# EAGLE design ESP devkit ver.1 (EAGLE 9.6.2)
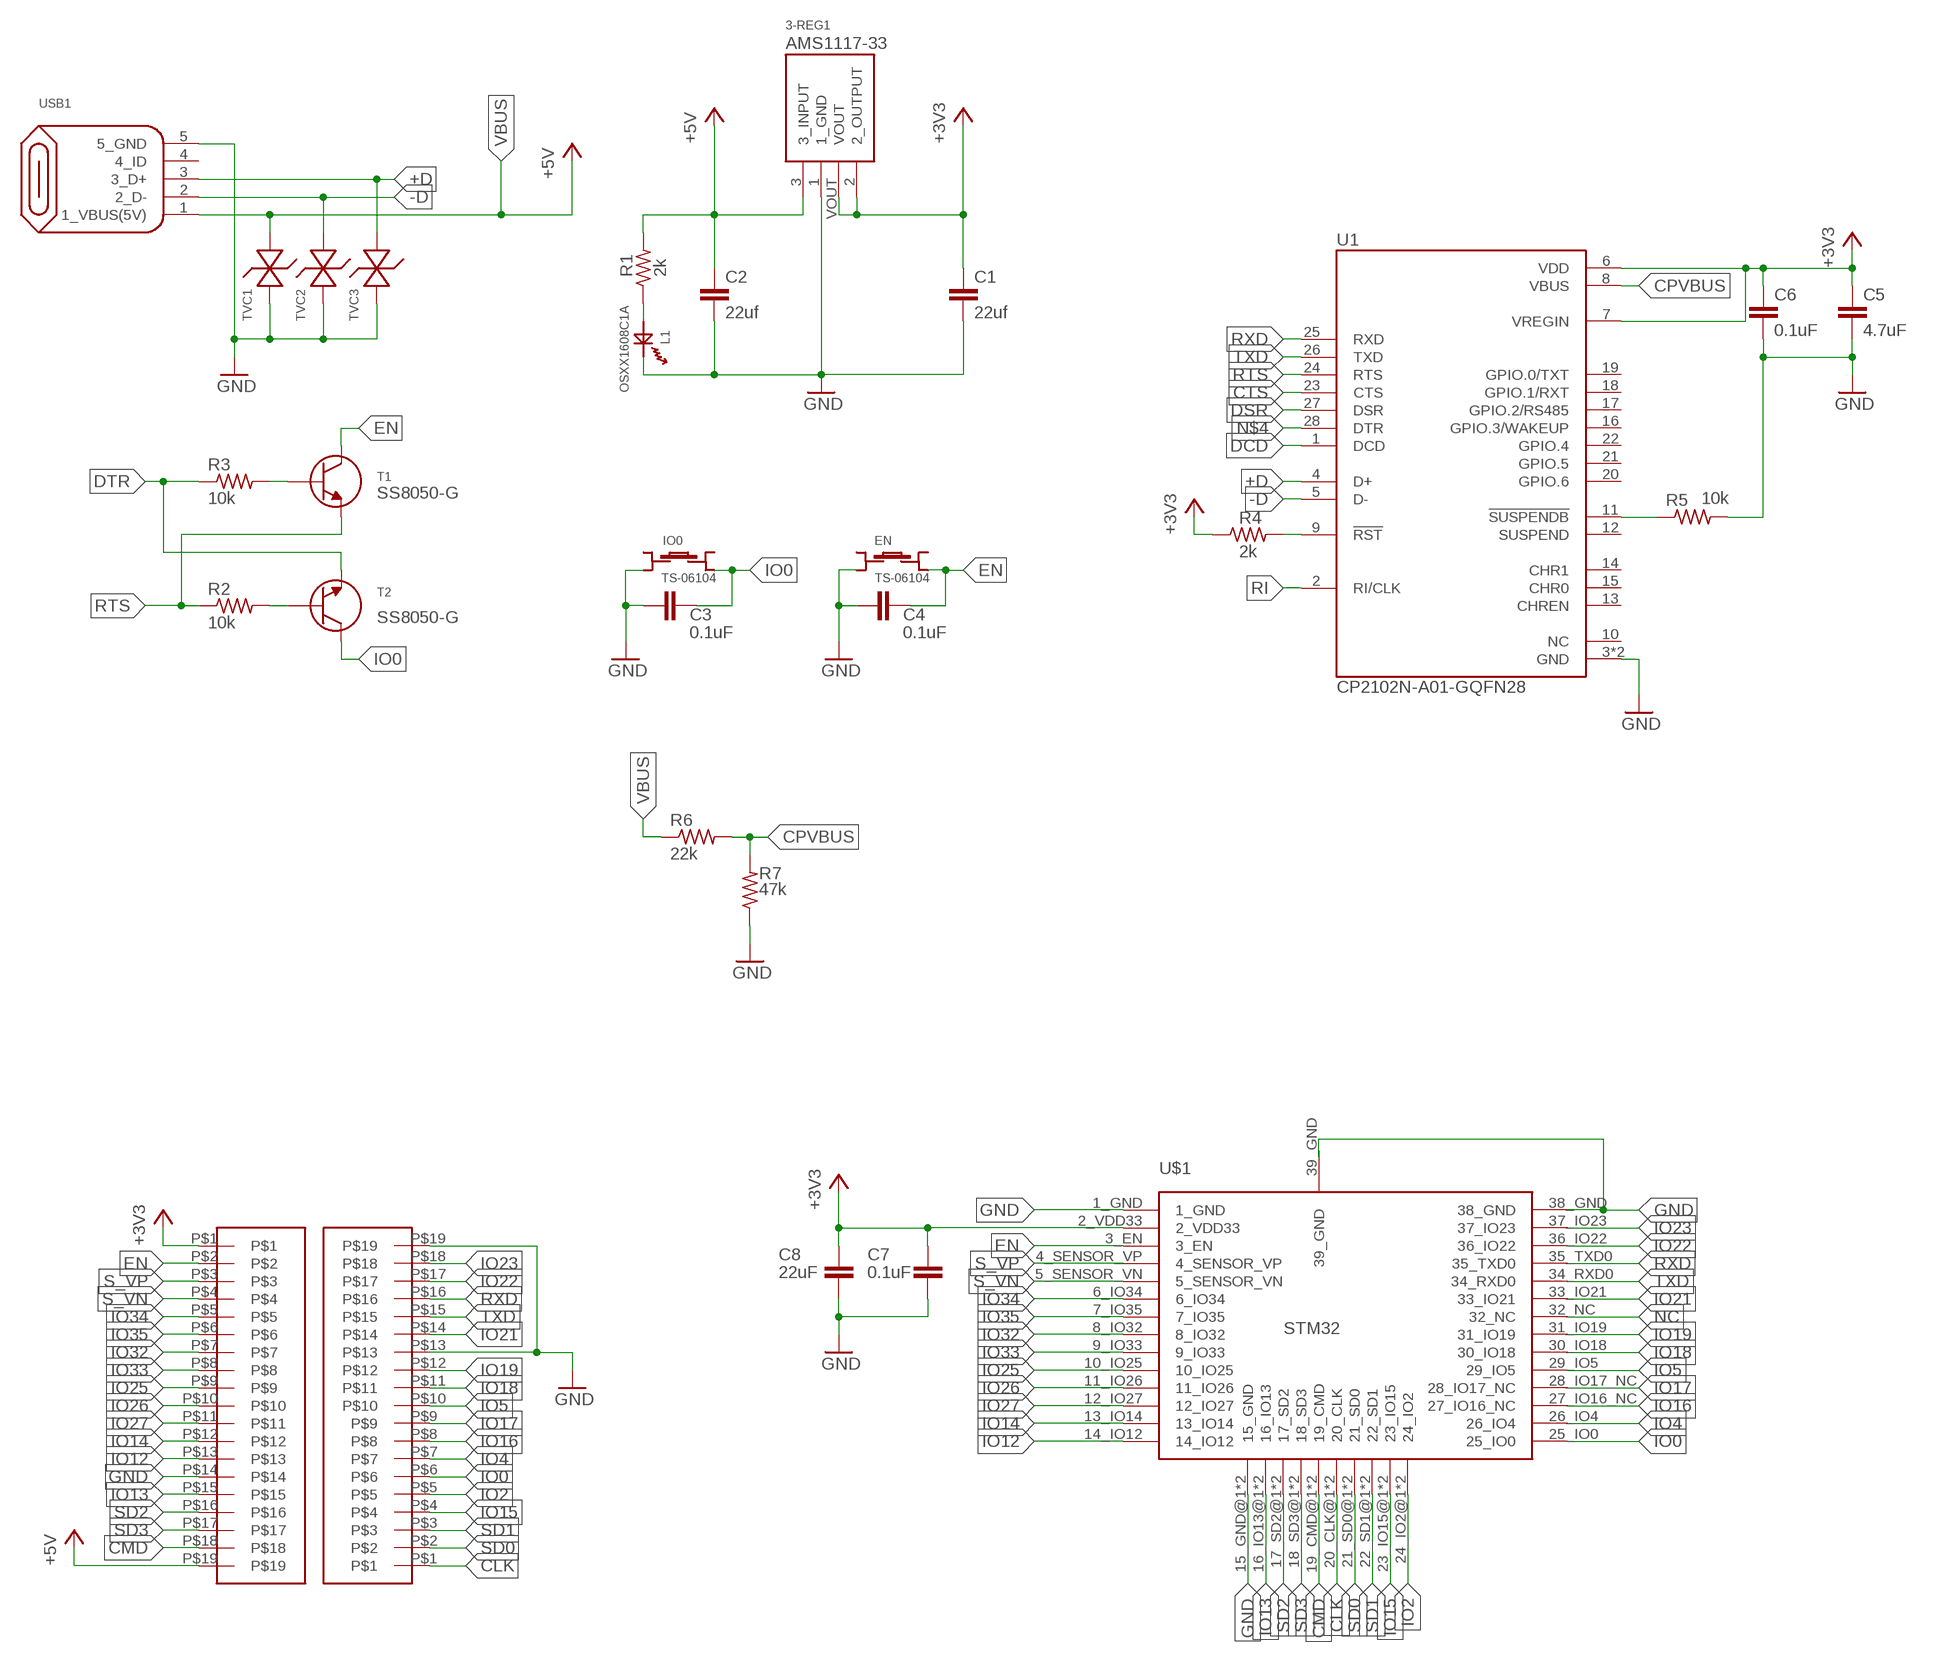
[diagram p0: schematic, sheet 1]

## Parts
3-REG1  AZ1117CH-3.3TRG1  [AZ1117CH-3.3TRG1]
C1  22uf  C-EUC0603  [C0603]
C2  22uf  C-EUC0603  [C0603]
C3  0.1uF  C-EUC0603  [C0603]
C4  0.1uF  C-EUC0603  [C0603]
C5  4.7uF  C-EUC0402  [C0402]
C6  0.1uF  C-EUC0603  [C0603]
C7  0.1uF  C-EUC0603  [C0603]
C8  22uF  C-EUC0603  [C0603]
EN  TS-06104  [TS-06104]
IO0  TS-06104  [TS-06104]
L1  OSXX1608C1A  [OSXX1608C1A]
R1  2k  R-US_R0201  [R0201]
R2  10k  R-US_R0201  [R0201]
R3  10k  R-US_R0201  [R0201]
R4  2k  R-US_R0201  [R0201]
R5  10k  R-US_R0201  [R0201]
R6  22k  R-US_R0201  [R0201]
R7  47k  R-US_R0201  [R0201]
T1  NPN_SS8050-G  [NPN_SS8050-G]
T2  NPN_SS8050-G  [NPN_SS8050-G]
TVC1  ESD5484FCT5G  [ESD5484FCT5G]
TVC2  ESD5484FCT5G  [ESD5484FCT5G]
TVC3  ESD5484FCT5G  [ESD5484FCT5G]
U1  CP2102N-A01-GQFN28  [QFN50P500X500X80-29N]
U$1  ESP32-WROOM&WROVER  [ESP32-WROVER&WROOM]
U$4  19_2.54  [19_2.54]
U$5  19_2.54  [19_2.54]
USB1  MICRO-B_ZX62R-B-5P  [MICRO-B_ZX62R-B-5P]

## Nets
+3V3 [esp]: 3-REG1.2(2_OUTPUT) 3-REG1.VOUT C1.1 C5.1 C6.1 C7.1 C8.1 R4.1 U1.6(VDD) U1.7(VREGIN) U$1.2_VDD33 U$4.P$1
+5V [esp]: 3-REG1.3(3_INPUT) C2.1 R1.2 U$4.P$19
+D [esp]: TVC3.2_AN U1.4(D+) USB1.3(3_D+)
-D [esp]: TVC2.2_AN U1.5(D-) USB1.2(2_D-)
CLK [esp]: U$1.20_CLK@1(20_CLK) U$1.20_CLK@2(20_CLK) U$5.P$1
CMD [esp]: U$1.19_CMD@1(19_CMD) U$1.19_CMD@2(19_CMD) U$4.P$18
CPVBUS [esp]: R6.2 R7.2 U1.8(VBUS)
CTS [esp]: U1.23(CTS)
DCD [esp]: U1.1(DCD)
DSR [esp]: U1.27(DSR)
DTR [esp]: R3.1 T2.2
EN [esp]: C4.1 EN.D T1.3 U$1.3_EN U$4.P$2
GND [esp]: 3-REG1.1(1_GND) C1.2 C2.2 C3.2 C4.2 C5.2 C6.2 C7.2 C8.2 EN.B IO0.B L1.CT R5.2 R7.1 TVC1.1_CT TVC2.1_CT TVC3.1_CT U1.3(GND) U1.29(GND) U$1.1_GND U$1.15_GND@1(15_GND) U$1.15_GND@2(15_GND) U$1.38_GND U$1.39_GND U$4.P$14 U$5.P$13 U$5.P$19 USB1.5(5_GND)
IO0 [esp]: C3.1 IO0.D T2.3 U$1.25_IO0 U$5.P$6
IO2 [esp]: U$1.24_IO2@1(24_IO2) U$1.24_IO2@2(24_IO2) U$5.P$5
IO4 [esp]: U$1.26_IO4 U$5.P$7
IO5 [esp]: U$1.29_IO5 U$5.P$10
IO12 [esp]: U$1.14_IO12 U$4.P$13
IO13 [esp]: U$1.16_IO13@1(16_IO13) U$1.16_IO13@2(16_IO13) U$4.P$15
IO14 [esp]: U$1.13_IO14 U$4.P$12
IO15 [esp]: U$1.23_IO15@1(23_IO15) U$1.23_IO15@2(23_IO15) U$5.P$4
IO16 [esp]: U$1.27_IO16_NC U$5.P$8
IO17 [esp]: U$1.28_IO17_NC U$5.P$9
IO18 [esp]: U$1.30_IO18 U$5.P$11
IO19 [esp]: U$1.31_IO19 U$5.P$12
IO21 [esp]: U$1.33_IO21 U$5.P$14
IO22 [esp]: U$1.36_IO22 U$5.P$17
IO23 [esp]: U$1.37_IO23 U$5.P$18
IO25 [esp]: U$1.10_IO25 U$4.P$9
IO26 [esp]: U$1.11_IO26 U$4.P$10
IO27 [esp]: U$1.12_IO27 U$4.P$11
IO32 [esp]: U$1.8_IO32 U$4.P$7
IO33 [esp]: U$1.9_IO33 U$4.P$8
IO34 [esp]: U$1.6_IO34 U$4.P$5
IO35 [esp]: U$1.7_IO35 U$4.P$6
N$1 [esp]: L1.AN R1.1
N$2 [esp]: R3.2 T1.1
N$4 [esp]: U1.28(DTR)
N$5 [esp]: R2.2 T2.1
N$8 [esp]: R4.2 U1.9(!RST)
N$10 [esp]: R5.1 U1.11(!SUSPENDB)
NC [esp]: U$1.32_NC
RI [esp]: U1.2(RI/CLK)
RTS [esp]: R2.1 T1.2 U1.24(RTS)
RXD [esp]: U1.25(RXD) U$1.35_TXD0 U$5.P$16
S_VN [esp]: U$1.5_SENSOR_VN U$4.P$4
S_VP [esp]: U$1.4_SENSOR_VP U$4.P$3
SD0 [esp]: U$1.21_SD0@1(21_SD0) U$1.21_SD0@2(21_SD0) U$5.P$2
SD1 [esp]: U$1.22_SD1@1(22_SD1) U$1.22_SD1@2(22_SD1) U$5.P$3
SD2 [esp]: U$1.17_SD2@1(17_SD2) U$1.17_SD2@2(17_SD2) U$4.P$16
SD3 [esp]: U$1.18_SD3@1(18_SD3) U$1.18_SD3@2(18_SD3) U$4.P$17
TXD [esp]: U1.26(TXD) U$1.34_RXD0 U$5.P$15
VBUS [esp]: R6.1 TVC1.2_AN USB1.1(1_VBUS(5V)) ; supply symbol labelled +5V
Unconnected: EN.A EN.C IO0.A IO0.C U1.10(NC) U1.12(SUSPEND) U1.13(CHREN) U1.14(CHR1) U1.15(CHR0) U1.16(GPIO.3/WAKEUP) U1.17(GPIO.2/RS485) U1.18(GPIO.1/RXT) U1.19(GPIO.0/TXT) U1.20(GPIO.6) U1.21(GPIO.5) U1.22(GPIO.4) USB1.4(4_ID)

## Notes on the sheet
- SS8050-G
- SS8050-G

## Library data of the parts
3-REG1 = Chip 3-Terminal Regulator:AZ1117CH-3.3TRG1
C1-C8 = rcl:C-EU: CAPACITOR, European symbol; SPICEPREFIX: C
EN IO0 = Switches:TS-06104
L1 = ChipLED:OSXX1608C1A
R1-R7 = rcl:R-US_: RESISTOR, American symbol; SPICEPREFIX: R
T1 T2 = ChipTransister:NPN_SS8050-G
TVC1-TVC3 = TVC Diode:ESD5484FCT5G
U1 = CP2102N-A01-GQFN28:CP2102N-A01-GQFN28: USB Bridge, USB to UART USB 2.0 UART Interface 28-QFN (5x5) Check availability <https://pricing.snapeda.com/parts/CP2102N-A01-GQFN28/Silicon%20Labs/view-part?ref=eda>; AVAILABILITY: In Stock; DESCRIPTION: USB Bridge, USB to UART USB 2.0 UART Interface 28-QFN (5x5); MF: Silicon Labs; MP: CP2102N-A01-GQFN28; PACKAGE: QFN-28 Silicon Labs; PRICE: None; PURCHASE-URL: https://pricing.snapeda.com/search/part/CP2102N-A01-GQFN28/?ref=eda
U$1 = ESP32:ESP32-WROOM&WROVER
U$4 U$5 = JumperPins:19_2.54
USB1 = USB:MICRO-B_ZX62R-B-5P

## Net classes
1 esp: width 0.254 mm, drill 0.127 mm, clearance 0.025 mm

## Board
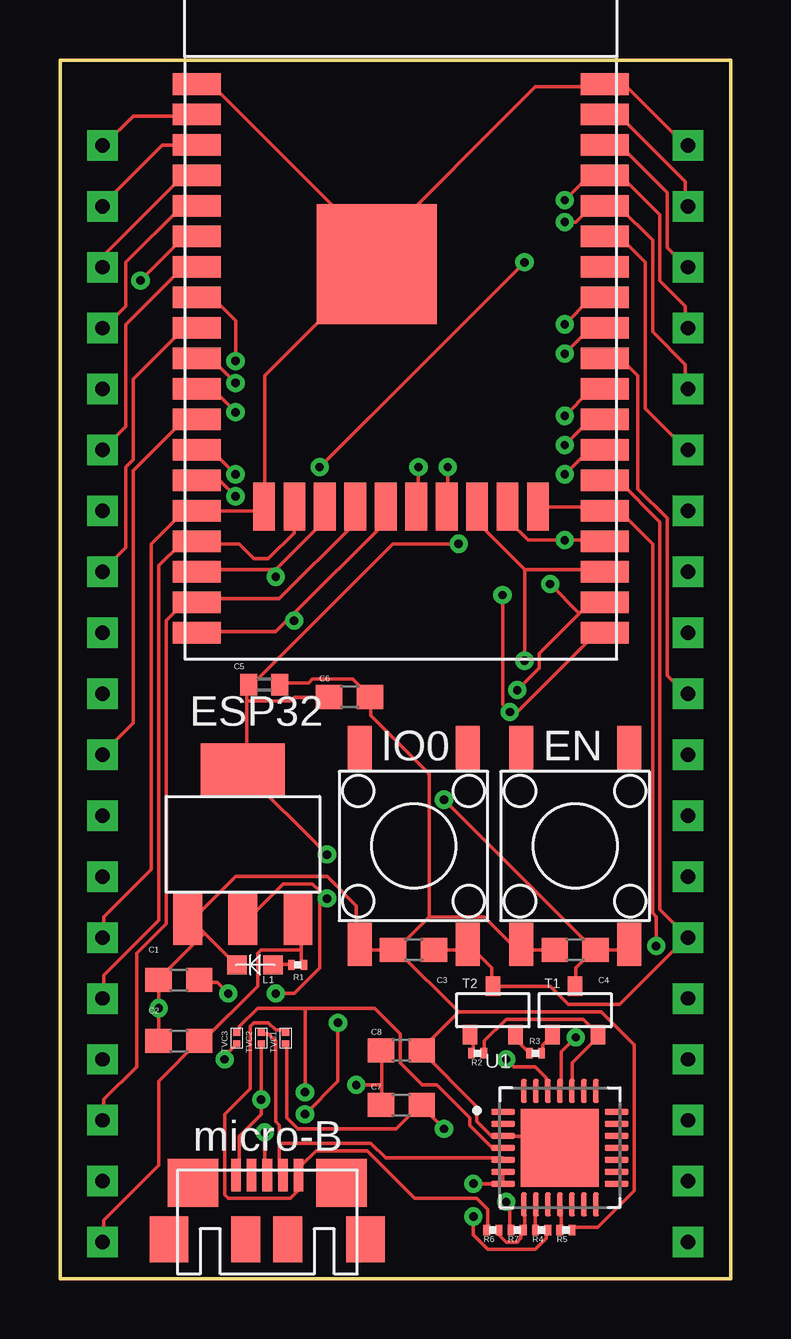
[diagram p1: board, top side]
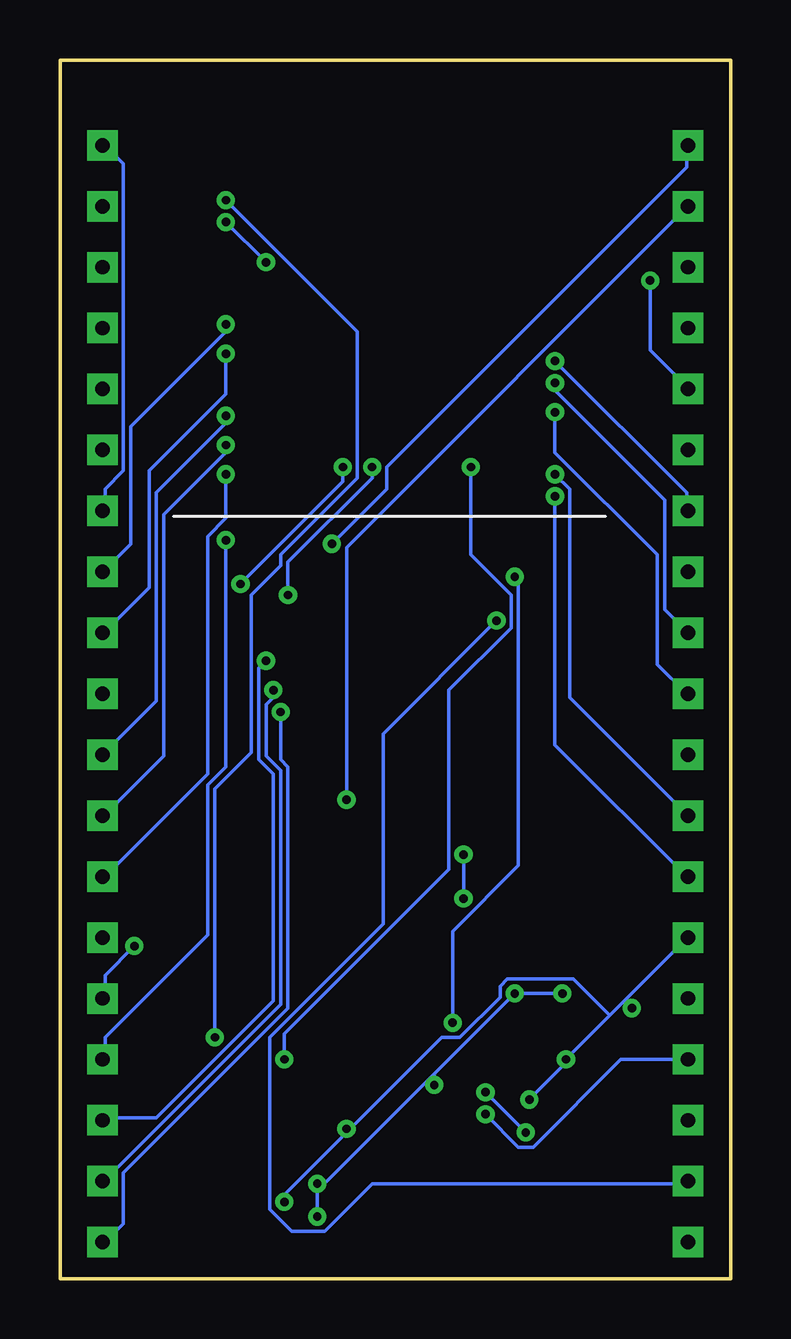
[diagram p2: board, bottom side, seen from below]

Size 27.94 x 50.8 mm. Coordinates in mm from the lower left corner, seen from the top.
Outline: 0,0 27.94,0 27.94,50.8 0,50.8 0,0
Copper layers (1*16): Top 0.035mm / dielectric 1.5mm / Bottom 0.035mm
Design rules "default": minimum track width 6mil, minimum drill 0.35mm, track to track 6mil, track to pad 6mil, pad to pad 6mil, via to via 6mil, smd to smd 6mil, copper to edge 40mil, drill to drill 6mil, minimum pad ring 10mil, minimum via ring 8mil, stop-mask expansion 4mil, vias tented up to drill 0mil, thermal gap 10mil

### Footprints (pad centres in the part's own frame; a part is rotated, then mirrored left to right if it is on the bottom)
AZ1117CH-3.3TRG1 = smd 1.2 x 2.2: 1 -2.3,-6.2; 2 0,-6.2; 3 2.3,-6.2 | smd 3.5 x 2.2: VOUT 0,0
C0603 = smd 1.1 x 1: 1 -0.85,0; 2 0.85,0
C0402 = smd 0.7 x 0.9: 1 -0.65,0; 2 0.65,0
TS-06104 = smd 1 x 1.8: A -2.25,4.1; B -2.25,-4.1; C 2.25,4.1; D 2.25,-4.1
OSXX1608C1A = smd 0.8 x 0.8: AN -0.75,0; CT 0.75,0
R0201 = smd 0.28 x 0.43: 1 -0.255,0; 2 0.255,0
NPN_SS8050-G = smd 0.6 x 0.8: 1 -0.95,-2.02; 2 0.95,-2.02; 3 0,0
ESD5484FCT5G = smd 0.28 x 0.3: 1_CT -0.235,0; 2_AN 0.235,0
QFN50P500X500X80-29N = smd 1.01 x 0.27: 1 -2.36,1.5; 2 -2.36,1; 3 -2.36,0.5; 4 -2.36,0; 5 -2.36,-0.5; 6 -2.36,-1; 7 -2.36,-1.5; 15 2.36,-1.5; 16 2.36,-1; 17 2.36,-0.5; 18 2.36,0; 19 2.36,0.5; 20 2.36,1; 21 2.36,1.5 | smd 0.27 x 1.01: 8 -1.5,-2.36; 9 -1,-2.36; 10 -0.5,-2.36; 11 0,-2.36; 12 0.5,-2.36; 13 1,-2.36; 14 1.5,-2.36; 22 1.5,2.36; 23 1,2.36; 24 0.5,2.36; 25 0,2.36; 26 -0.5,2.36; 27 -1,2.36; 28 -1.5,2.36 | smd 3.25 x 3.25: 29 0,0
ESP32-WROVER&WROOM = smd 2 x 0.9: 1_GND -7.5,7.5; 2_VDD33 -7.5,6.23; 3_EN -7.5,4.96; 4_SENSOR_VP -7.5,3.69; 5_SENSOR_VN -7.5,2.42; 6_IO34 -7.5,1.15; 7_IO35 -7.5,-0.12; 8_IO32 -7.5,-1.39; 9_IO33 -7.5,-2.66; 10_IO25 -7.5,-3.93; 11_IO26 -7.5,-5.2; 12_IO27 -7.5,-6.47; 13_IO14 -7.5,-7.74; 14_IO12 -7.5,-9.01; 15_GND@1 -7.5,-10.28; 16_IO13@1 -7.5,-11.55; 17_SD2@1 -7.5,-12.82; 18_SD3@1 -7.5,-14.09; 19_CMD@1 -7.5,-15.36; 20_CLK@1 9.5,-15.36; 21_SD0@1 9.5,-14.09; 22_SD1@1 9.5,-12.82; 23_IO15@1 9.5,-11.55; 24_IO2@1 9.5,-10.28; 25_IO0 9.5,-9.01; 26_IO4 9.5,-7.74; 27_IO16_NC 9.5,-6.47; 28_IO17_NC 9.5,-5.2; 29_IO5 9.5,-3.93; 30_IO18 9.5,-2.66; 31_IO19 9.5,-1.39; 32_NC 9.5,-0.12; 33_IO21 9.5,1.15; 34_RXD0 9.5,2.42; 35_TXD0 9.5,3.69; 36_IO22 9.5,4.96; 37_IO23 9.5,6.23; 38_GND 9.5,7.5 | smd 0.9 x 2: 15_GND@2 -4.715,-10.1; 16_IO13@2 -3.445,-10.1; 17_SD2@2 -2.175,-10.1; 18_SD3@2 -0.905,-10.1; 19_CMD@2 0.365,-10.1; 20_CLK@2 1.635,-10.1; 21_SD0@2 2.905,-10.1; 22_SD1@2 4.175,-10.1; 23_IO15@2 5.445,-10.1; 24_IO2@2 6.715,-10.1 | smd 5 x 5: 39_GND 0,0
19_2.54 = drill 0.6 pad 1.27 square: P$1 0,12.7; P$2 0,10.16; P$3 0,7.62; P$4 0,5.08; P$5 0,2.54; P$6 0,0; P$7 0,-2.54; P$8 0,-5.08; P$9 0,-7.62; P$10 0,-10.16; P$11 0,-12.7; P$12 0,-15.24; P$13 0,-17.78; P$14 0,-20.32; P$15 0,-22.86; P$16 0,-25.4; P$17 0,-27.94; P$18 0,-30.48; P$19 0,-33.02
MICRO-B_ZX62R-B-5P = smd 0.4 x 1.35: 1 1.3,0; 2 0.65,0; 3 0,0; 4 -0.65,0; 5 -1.3,0 | smd 2.1 x 2: P$6 3.1,-0.325; P$7 -3.1,-0.325 | smd 1.6 x 1.9: P$8 -4.1,-2.675; P$9 4.1,-2.675 | smd 1.2 x 1.9: P$10 0.85,-2.675; P$11 -0.9,-2.675

### Placement (x,y rotation side)
3-REG1  7.62,21.21 0 top
C1  4.95,12.45 180 top
C2  4.95,9.91 180 top
C3  14.73,13.72 180 top
C4  21.46,13.72 180 top
C5  8.51,24.77 0 top
C6  12.06,24.26 0 top
C7  14.22,7.24 0 top
C8  14.22,9.53 0 top
EN  21.46,18.03 0 top
IO0  14.73,18.03 0 top
L1  8.13,13.08 180 top
R1  9.91,13.08 0 top
R2  17.4,9.4 180 top
R3  19.81,9.4 0 top
R4  20.07,2.03 180 top
R5  21.08,2.03 0 top
R6  18.03,2.03 0 top
R7  19.05,2.03 0 top
T1  21.46,12.19 0 top
T2  18.03,12.19 0 top
TVC1  9.4,10.03 90 top
TVC2  8.38,10.03 90 top
TVC3  7.37,10.03 90 top
U1  20.83,5.46 0 top
U$1  13.21,42.29 0 top
U$4  1.78,34.54 0 top
U$5  26.16,14.22 180 top
USB1  8.64,4.32 0 top

### Tracks (layer width: path | path; a pad name or v marks a point on that pad's centre or on a via)
+3V3  (via drill 0.35)
  Top 0.152: 13.41,8.08 13.41,9.45 C8.1 | 13.41,8.08 13.41,7.32 C7.1 | v17.22,2.59 17.22,1.83 17.83,1.22 19.81,1.22 20.27,1.68 20.27,1.98 R4.1 | 18.44,3.96 v17.22,3.96 | 18.44,3.96 18.44,4.42 U1.6 | 18.44,3.96 U1.7 | v7.01,11.89 6.55,12.34 5.94,12.34 C1.1 | v12.34,8.08 13.41,8.08 | 10.82,15.85 10.82,12.95 9.75,11.89 v8.99,11.89 | 10.82,15.85 10.82,16.15 10.52,16.46 9.3,16.46 7.92,15.09 7.62,15.09 3-REG1.2 | U$1.2_VDD33 5.64,48.46 3.05,48.46 1.83,47.24 U$4.P$1 | 7.77,24.08 7.77,21.49 7.62,21.34 3-REG1.VOUT 7.62,21.18 v11.12,17.68 | 7.77,24.08 7.77,24.69 C5.1 7.92,24.69 13.87,30.63 v16.61,30.63 | 7.77,24.08 9.6,24.08 9.75,24.23 11.12,24.23 C6.1 | v11.12,15.85 10.82,15.85
  Bottom 0.152: 17.22,3.66 v17.22,2.59 | v7.01,11.89 v8.99,11.89 12.34,8.53 | 17.22,3.66 12.34,8.53 | 17.22,3.66 v17.22,3.96 | 12.34,8.53 v12.34,8.08 | v16.61,30.63 14.33,32.92 14.33,33.83 1.83,46.33 1.83,47.24 U$4.P$1 | v11.12,17.68 v11.12,15.85
+5V
  Top 0.152: 10.06,13.72 10.06,14.94 3-REG1.3 | 10.06,13.72 10.06,13.11 R1.2 | 10.06,13.72 8.38,13.72 8.23,13.56 8.23,12.19 5.94,9.91 C2.1 4.12,8.23 4.12,4.72 1.83,2.44 1.83,1.52 U$4.P$19
+D  (via drill 0.35)
  Top 0.152: 10.21,11.28 13.11,11.28 14.17,10.21 14.17,8.99 15.09,8.08 15.7,8.08 17.07,6.71 17.07,6.4 17.98,5.49 18.44,5.49 U1.4 | 10.21,11.28 8.23,11.28 7.47,10.52 7.47,10.36 TVC3.2_AN | v8.53,6.1 8.53,4.42 USB1.3 | 10.21,11.28 v10.21,7.77
  Bottom 0.152: v10.21,7.77 v8.53,6.1
-D
  Top 0.152: 9.14,5.64 9.14,4.42 USB1.2 | 9.14,5.64 9.14,6.4 8.99,6.55 8.99,9.91 8.69,10.21 8.38,10.21 TVC2.2_AN | 9.14,5.64 12.95,5.64 13.56,5.03 18.44,5.03 U1.5
CLK  (via drill 0.35)
  Top 0.152: U$1.20_CLK@1 22.71,26.82 22.25,26.82 19.05,23.62 v18.75,23.62 18.44,23.93 v18.44,28.5 | v14.94,33.83 14.94,32.31 U$1.20_CLK@2
  Bottom 0.152: v18.75,23.62 18.75,21.64 18.44,21.34 18.44,11.28 25.3,4.42 25.3,2.29 26.06,1.52 U$5.P$1 | v14.94,33.83 14.94,33.38 18.44,29.87 v18.44,28.5
CMD  (via drill 0.35)
  Top 0.152: 9.6,27.58 13.56,31.55 13.56,32.16 U$1.19_CMD@2 | 9.6,27.58 8.99,26.98 5.79,26.98 U$1.19_CMD@1 | 9.6,27.58 v9.75,27.43
  Bottom 0.152: v9.75,27.43 14.48,22.71 14.48,14.78 19.2,10.06 19.2,2.9 18.29,1.98 16.92,1.98 14.94,3.96 1.83,3.96 U$4.P$18
CPVBUS
  Top 0.152: R6.2 18.29,1.98 18.29,1.83 18.59,1.52 19.05,1.52 19.2,1.68 19.2,1.98 R7.2 19.36,2.13 19.36,3.05 U1.8
DTR
  Top 0.152: R3.1 19.51,9.45 18.9,10.06 T2.2
EN  (via drill 0.35)
  Top 0.152: 22.25,13.72 21.49,12.95 21.49,12.19 T1.3 | EN.D 23.62,13.87 23.47,13.72 C4.1 22.25,13.72 | U$1.3_EN 5.64,47.24 4.27,47.24 1.83,44.81 U$4.P$2 | v16,19.96 22.25,13.72
  Bottom 0.152: v16,19.96 16,30.48 U$4.P$2
GND  (via drill 0.35)
  Top 0.152: C2.2 4.12,9.91 v4.12,11.28 4.12,12.34 C1.2 4.12,12.5 5.94,14.33 5.94,14.48 | 5.49,14.94 5.33,15.09 3-REG1.1 5.49,14.94 | 5.49,14.94 5.94,14.48 | 5.94,14.48 7.32,13.11 L1.CT | U1.29 20.73,5.49 20.27,5.94 18.59,5.94 U1.3 18.44,5.94 17.98,5.94 17.37,6.55 17.37,7.16 15.09,9.45 C8.2 15.09,9.6 16.61,11.12 | C5.2 9.3,24.84 10.36,24.84 10.52,24.99 12.19,24.99 12.8,24.38 C6.2 12.95,24.23 12.95,23.47 15.39,21.03 15.39,15.09 | C4.2 19.51,13.72 19.36,13.87 EN.B 19.2,14.02 18.75,14.02 17.68,15.09 15.39,15.09 | 16.61,11.12 22.55,11.12 23.93,9.75 23.93,3.66 22.4,2.13 21.34,2.13 R5.2 | 16.61,11.12 14.02,13.72 | 14.02,13.72 15.39,15.09 | 14.02,13.72 C3.2 12.65,13.72 12.5,13.87 IO0.B 12.34,14.02 12.34,15.54 11.12,16.76 7.32,16.76 5.49,14.94 | TVC1.1_CT 9.45,9.75 9.45,6.71 9.91,6.25 14.02,6.25 14.94,7.16 C7.2 15.09,7.16 v16,6.25 | TVC2.1_CT v8.38,7.47 8.38,6.86 7.47,5.94 7.47,4.42 USB1.5 | v6.86,9.14 6.86,9.3 7.32,9.75 TVC3.1_CT | v18.59,3.2 18.75,3.05 18.75,2.13 R7.1 | U$5.P$19 26.06,47.24 23.62,49.68 22.86,49.68 U$1.38_GND 22.71,49.68 19.81,49.68 13.11,42.98 | 13.11,42.98 6.4,49.68 5.79,49.68 U$1.1_GND | 13.11,42.98 13.11,42.37 U$1.39_GND | U$1.39_GND 13.11,42.22 8.53,37.64 8.53,32.31 U$1.15_GND@2 8.38,32.16 8.23,32 5.79,32 U$1.15_GND@1 5.64,32 5.18,32 3.81,30.63 3.81,17.07 1.83,15.09 1.83,14.33 U$4.P$14 | 13.11,42.98 U$1.39_GND
  Bottom 0.152: U$4.P$14 4.42,11.58 | 4.42,11.58 5.03,10.97 | 5.03,10.97 v6.86,9.14 6.86,8.99 v8.38,7.47 | v18.59,3.2 18.59,3.5 15.85,6.25 | 15.85,6.25 12.04,10.06 11.28,10.06 9.6,11.73 9.6,12.19 9.3,12.5 6.55,12.5 5.03,10.97 | 15.85,6.25 v16,6.25 | U$5.P$13 26.06,32 26.06,32.92 25.3,33.68 25.3,46.48 26.06,47.24 U$5.P$19 | 4.42,11.58 v4.12,11.28
IO0
  Top 0.152: C3.1 16.76,13.72 IO0.D 17.07,13.87 17.98,12.95 17.98,12.19 T2.3 20.42,12.19 21.18,11.43 23.32,11.43 26.06,14.17 U$5.P$6 24.99,15.39 24.99,31.55 23.32,33.22 22.86,33.22 U$1.25_IO0
IO2  (via drill 0.35)
  Top 0.152: U$1.24_IO2@2 19.96,32.16 22.71,32.16 U$1.24_IO2@1 22.86,32 23.32,32 24.69,30.63 24.69,15.24 24.84,15.09 v24.84,13.87
  Bottom 0.152: v24.84,13.87 26.06,12.65 26.06,11.73 U$5.P$5
IO4  (via drill 0.35)
  Top 0.152: v21.03,33.53 21.95,34.44 22.71,34.44 U$1.26_IO4
  Bottom 0.152: v21.03,33.53 21.03,31.7 21.79,30.94 21.79,21.03 26.06,16.76 U$5.P$7
IO5
  Top 0.152: U$1.29_IO5 22.86,38.25 23.47,38.25 24.08,37.64 24.08,32.92 25.3,31.7 25.3,25.15 26.06,24.38 U$5.P$10
IO12  (via drill 0.35)
  Top 0.152: v7.32,32.61 6.71,33.22 5.79,33.22 U$1.14_IO12
  Bottom 0.152: v7.32,32.61 7.32,22.25 1.83,16.76 U$4.P$13
IO13
  Top 0.152: U$1.16_IO13@2 9.75,32.16 9.75,31.09 8.69,30.02 8.08,30.02 7.47,30.63 5.79,30.63 U$1.16_IO13@1 5.64,30.63 5.03,30.63 4.12,29.72 4.12,14.94 1.83,12.65 1.83,11.73 U$4.P$15
IO14  (via drill 0.35)
  Top 0.152: v7.32,33.53 6.4,34.44 5.79,34.44 U$1.13_IO14
  Bottom 0.152: v7.32,33.53 6.71,32.92 6.71,24.23 U$4.P$12
IO15  (via drill 0.35)
  Top 0.152: U$1.23_IO15@1 22.71,30.79 v21.03,30.79 19.51,30.79 18.75,31.55 18.75,32.16 U$1.23_IO15@2
  Bottom 0.152: v21.03,30.79 21.03,21.34 21.79,20.57 21.79,14.33 26.06,10.06 26.06,9.14 U$5.P$4
IO16  (via drill 0.35)
  Top 0.152: v21.03,34.75 22.1,35.81 U$1.27_IO16_NC
  Bottom 0.152: v21.03,34.75 21.03,34.44 23.62,31.85 23.62,21.79 26.06,19.36 U$5.P$8
IO17  (via drill 0.35)
  Top 0.152: v21.03,35.97 22.1,37.03 22.71,37.03 U$1.28_IO17_NC
  Bottom 0.152: v21.03,35.97 21.03,35.66 23.93,32.77 23.93,24.08 U$5.P$9
IO18  (via drill 0.35)
  Top 0.152: v21.03,38.56 22.1,39.62 U$1.30_IO18
  Bottom 0.152: v21.03,38.56 21.03,36.88 24.23,33.68 24.23,28.8 26.06,26.98 U$5.P$11
IO19  (via drill 0.35)
  Top 0.152: v21.03,39.78 22.1,40.84 22.71,40.84 U$1.31_IO19
  Bottom 0.152: v21.03,39.78 21.03,39.47 24.99,35.51 24.99,30.63 U$5.P$12
IO21
  Top 0.152: U$1.33_IO21 22.86,43.43 23.32,43.43 24.38,42.37 24.38,36.27 26.06,34.59 U$5.P$14
IO22
  Top 0.152: U$1.36_IO22 22.86,47.24 23.32,47.24 25.3,45.26 25.3,42.98 26.06,42.22 U$5.P$17
IO23
  Top 0.152: U$1.37_IO23 22.86,48.46 23.32,48.46 26.06,45.72 26.06,44.81 U$5.P$18
IO25  (via drill 0.35)
  Top 0.152: v7.32,37.34 6.4,38.25 5.79,38.25 U$1.10_IO25
  Bottom 0.152: v7.32,37.34 7.32,37.03 2.74,32.46 2.74,27.89 U$4.P$9
IO26  (via drill 0.35)
  Top 0.152: v7.32,36.12 6.4,37.03 5.79,37.03 U$1.11_IO26
  Bottom 0.152: v7.32,36.12 7.32,34.44 3.05,30.18 3.05,25.6 1.83,24.38 U$4.P$10
IO27
  Top 0.152: U$1.12_IO27 5.64,35.81 5.18,35.81 3.05,33.68 3.05,23.16 1.83,21.95 U$4.P$11
IO32  (via drill 0.35)
  Top 0.152: v7.32,38.25 7.32,39.93 6.4,40.84 5.79,40.84 U$1.8_IO32
  Bottom 0.152: v7.32,38.25 1.83,32.77 1.83,32 U$4.P$7
IO33
  Top 0.152: U$1.9_IO33 5.64,39.62 5.18,39.62 3.05,37.49 3.05,34.14 2.74,33.83 2.74,30.48 1.83,29.57 U$4.P$8
IO34  (via drill 0.35)
  Top 0.152: v3.35,41.6 5.18,43.43 5.64,43.43 U$1.6_IO34
  Bottom 0.152: v3.35,41.6 3.35,38.71 1.83,37.19 U$4.P$5
IO35
  Top 0.152: U$4.P$6 2.74,35.51 2.74,39.78 5.03,42.06 5.64,42.06 U$1.7_IO35
N$1
  Top 0.152: R1.1 9.6,13.11 8.99,13.11 L1.AN
N$2
  Top 0.152: R3.2 20.12,9.45 20.12,9.75 20.42,10.06 T1.1
N$5
  Top 0.152: R2.2 17.22,9.45 17.22,10.06 T2.1
N$8
  Top 0.152: R4.2 19.81,2.13 19.81,3.05 U1.9
N$10
  Top 0.152: R5.1 20.88,2.13 20.88,3.05 U1.11
RTS
  Top 0.152: R2.1 17.68,9.45 17.68,9.91 18.59,10.82 21.79,10.82 22.4,10.21 T1.2 22.4,10.06 21.34,8.99 21.34,7.92 U1.24
RXD  (via drill 0.35)
  Top 0.152: v21.49,10.06 20.88,9.45 20.88,7.92 U1.25 | v21.03,44.96 21.95,45.87 22.71,45.87 U$1.35_TXD0 22.86,45.87 23.47,45.87 24.99,44.35 24.99,41.6 26.06,40.54 26.06,39.62 U$5.P$16
  Bottom 0.152: v21.49,10.06 21.49,20.42 19.96,21.95 19.96,28.5 18.75,29.72 18.75,30.18 15.54,33.38 15.54,39.47 v21.03,44.96
S_VN
  Top 0.152: U$1.5_SENSOR_VN 5.64,44.65 5.03,44.65 2.74,42.37 2.74,40.54 1.83,39.62 U$4.P$4
S_VP
  Top 0.152: U$1.4_SENSOR_VP 5.64,45.87 5.03,45.87 1.83,42.67 1.83,42.22 U$4.P$3
SD0  (via drill 0.35)
  Top 0.152: 21.64,27.74 19.96,26.06 19.96,25.45 v19.05,24.54 | 21.64,27.74 22.1,28.19 U$1.21_SD0@1 | v16.15,33.83 16.15,32.31 U$1.21_SD0@2 | 21.64,27.74 v20.42,28.96
  Bottom 0.152: v19.05,24.54 19.05,24.23 19.36,23.93 19.36,21.79 18.75,21.18 18.75,11.43 26.06,4.12 U$5.P$2 | v16.15,33.83 16.15,33.22 v20.42,28.96
SD1  (via drill 0.35)
  Top 0.152: 19.36,29.57 17.53,31.39 17.53,32.16 U$1.22_SD1@2 | 19.36,29.57 22.71,29.57 U$1.22_SD1@1 | 19.36,29.57 v19.36,25.76
  Bottom 0.152: v19.36,25.76 19.66,25.45 19.66,21.64 19.05,21.03 19.05,11.58 23.93,6.71 26.06,6.71 U$5.P$3
SD2  (via drill 0.35)
  Top 0.152: 8.99,29.57 5.79,29.57 U$1.17_SD2@1 | 8.99,29.57 10.97,31.55 10.97,32.16 U$1.17_SD2@2 | v10.21,6.86 11.58,8.23 v11.58,10.67 | 8.99,29.57 v8.99,29.26
  Bottom 0.152: U$4.P$16 4.57,9.14 8.23,5.49 8.84,5.49 v10.21,6.86 | v11.58,10.67 11.58,14.48 8.84,17.22 8.84,29.11 v8.99,29.26
SD3
  Top 0.152: U$1.18_SD3@2 12.19,32.16 12.19,31.39 9.14,28.35 5.79,28.35 U$1.18_SD3@1 5.64,28.19 5.18,28.19 4.42,27.43 4.42,14.78 3.2,13.56 3.2,8.84 1.83,7.47 1.83,6.71 U$4.P$17
TXD  (via drill 0.35)
  Top 0.152: v18.59,9.14 18.9,8.84 19.81,8.84 20.27,8.38 20.27,7.92 U1.26 | v19.36,42.37 v10.82,33.83 | v21.03,44.04 21.49,44.04 22.1,44.65 22.71,44.65 U$1.34_RXD0 22.86,44.65 23.32,44.65 24.69,43.28 24.69,39.47 26.06,38.1 26.06,37.19 U$5.P$15
  Bottom 0.152: v18.59,9.14 18.59,10.21 11.73,17.07 11.73,24.54 9.14,27.13 9.14,28.5 10.82,30.18 v10.82,33.83 | v21.03,44.04 v19.36,42.37
VBUS
  Top 0.152: TVC1.2_AN 9.3,10.36 8.99,10.36 8.69,10.67 8.08,10.67 7.92,10.52 7.92,7.92 6.86,6.86 6.86,3.5 7.01,3.35 9.6,3.35 9.91,3.66 9.91,4.27 USB1.1 10.06,4.42 10.06,4.72 10.67,5.33 12.8,5.33 14.78,3.35 17.37,3.35 17.83,2.9 17.83,2.13 R6.1